# EAGLE design StrainGageAmpSMD (EAGLE 9.6.2)
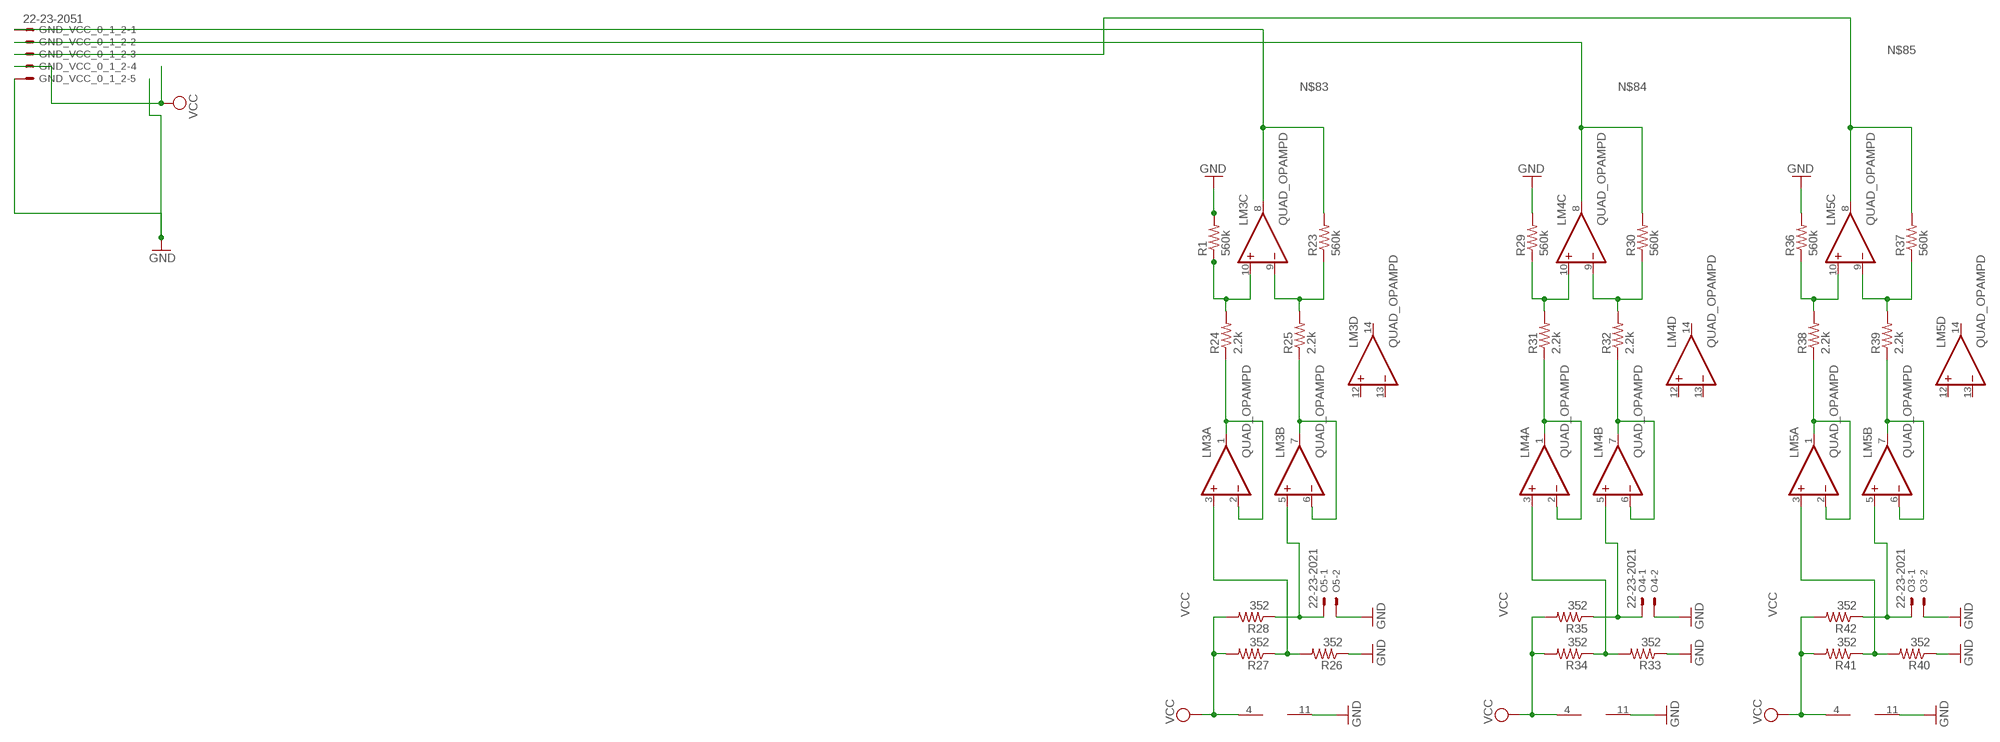
[diagram p0: schematic, sheet 1]

## Parts
GND_VCC_0_1_2  22-23-2051  [22-23-2051]
LM3  QUAD_OPAMPD  [SO14]
LM4  QUAD_OPAMPD  [SO14]
LM5  QUAD_OPAMPD  [SO14]
O3  22-23-2021  [22-23-2021]
O4  22-23-2021  [22-23-2021]
O5  22-23-2021  [22-23-2021]
R1  560k  R-US_R0603  [R0603]
R23  560k  R-US_R0603  [R0603]
R24  2.2k  R-US_R0603  [R0603]
R25  2.2k  R-US_R0603  [R0603]
R26  352  R-US_R0603  [R0603]
R27  352  R-US_R0603  [R0603]
R28  352  R-US_R0603  [R0603]
R29  560k  R-US_R0603  [R0603]
R30  560k  R-US_R0603  [R0603]
R31  2.2k  R-US_R0603  [R0603]
R32  2.2k  R-US_R0603  [R0603]
R33  352  R-US_R0603  [R0603]
R34  352  R-US_R0603  [R0603]
R35  352  R-US_R0603  [R0603]
R36  560k  R-US_R0603  [R0603]
R37  560k  R-US_R0603  [R0603]
R38  2.2k  R-US_R0603  [R0603]
R39  2.2k  R-US_R0603  [R0603]
R40  352  R-US_R0603  [R0603]
R41  352  R-US_R0603  [R0603]
R42  352  R-US_R0603  [R0603]

## Nets
GND: GND_VCC_0_1_2.5 LM3.11(P:V-) LM4.11(P:V-) LM5.11(P:V-) O3.2 O4.2 O5.2 R1.2 R26.1 R29.2 R33.1 R36.2 R40.1
N$21: LM3.3(A:+IN) R26.2 R27.1
N$22: LM3.5(B:+IN) O5.1 R28.1
N$23: LM3.1(A:OUT) LM3.2(A:-IN) R24.1
N$24: LM3.6(B:-IN) LM3.7(B:OUT) R25.1
N$25: LM3.9(C:-IN) R23.1 R25.2
N$26: LM3.10(C:+IN) R1.1 R24.2
N$27: LM4.3(A:+IN) R33.2 R34.1
N$28: LM4.5(B:+IN) O4.1 R35.1
N$29: LM4.1(A:OUT) LM4.2(A:-IN) R31.1
N$30: LM4.6(B:-IN) LM4.7(B:OUT) R32.1
N$31: LM4.9(C:-IN) R30.1 R32.2
N$32: LM4.10(C:+IN) R29.1 R31.2
N$33: LM5.3(A:+IN) R40.2 R41.1
N$34: LM5.5(B:+IN) O3.1 R42.1
N$35: LM5.1(A:OUT) LM5.2(A:-IN) R38.1
N$36: LM5.6(B:-IN) LM5.7(B:OUT) R39.1
N$37: LM5.9(C:-IN) R37.1 R39.2
N$38: LM5.10(C:+IN) R36.1 R38.2
N$83: GND_VCC_0_1_2.1 LM3.8(C:OUT) R23.2
N$84: GND_VCC_0_1_2.2 LM4.8(C:OUT) R30.2
N$85: GND_VCC_0_1_2.3 LM5.8(C:OUT) R37.2
VCC: GND_VCC_0_1_2.4 LM3.4(P:V+) LM4.4(P:V+) LM5.4(P:V+) R27.2 R28.2 R34.2 R35.2 R41.2 R42.2
Unconnected: LM3.12(D:+IN) LM3.13(D:-IN) LM3.14(D:OUT) LM4.12(D:+IN) LM4.13(D:-IN) LM4.14(D:OUT) LM5.12(D:+IN) LM5.13(D:-IN) LM5.14(D:OUT)

## Library data of the parts
GND_VCC_0_1_2 = con-molex:22-23-2051: .100" (2.54mm) Center Header - 5 Pin; MF: MOLEX; MPN: 22-23-2051; OC_FARNELL: 1462952; OC_NEWARK: 38C9178
LM3-LM5 = adafruit:QUAD_OPAMP: OP AMP Standard quad package
O3-O5 = con-molex:22-23-2021: .100" (2.54mm) Center Header - 2 Pin; MF: MOLEX; MPN: 22-23-2021; OC_FARNELL: 1462926; OC_NEWARK: 25C3832
R1 = rcl:R-US_: RESISTOR, American symbol; SPICEPREFIX: R
R23-R42 = adafruit:R-US_: RESISTOR, American symbol

## Module AMP
Ports: 

### Library data of the parts

## Net classes
0 default: width 0.203 mm, drill 0.254 mm, clearance 0.254 mm

## Board
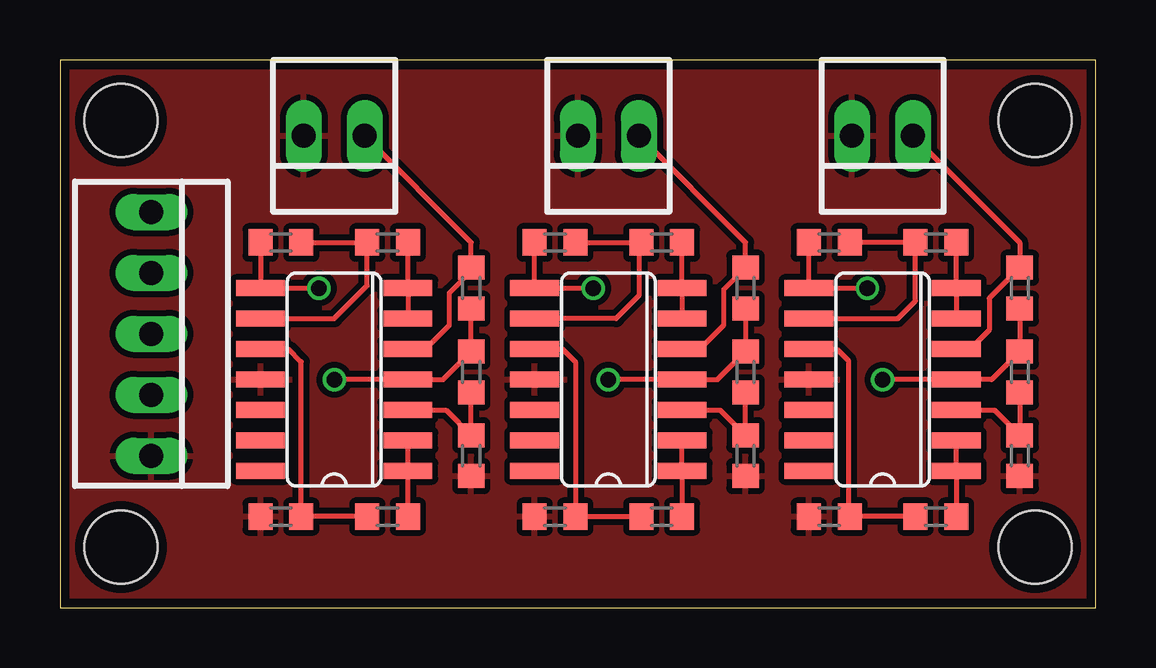
[diagram p1: board, top side]
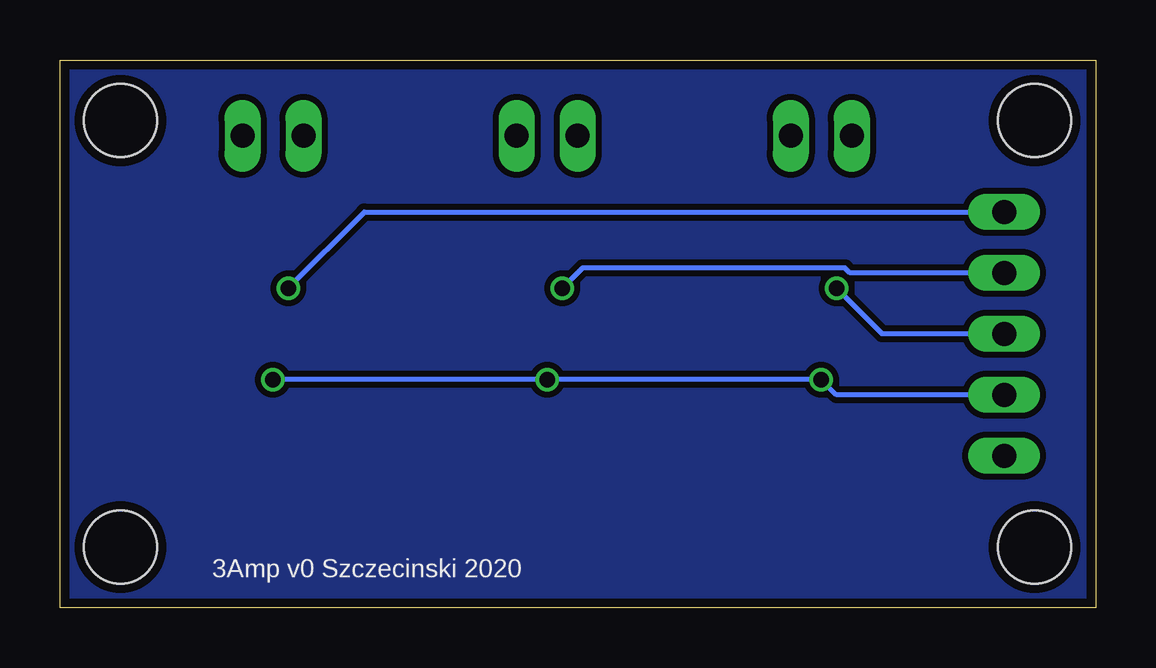
[diagram p2: board, bottom side, seen from below]

Size 43.17 x 22.85 mm. Coordinates in mm from the lower left corner, seen from the top.
Outline: 0,0 43.17,0 43.17,22.85 0,22.85 0,0
Copper layers (1*16): Top 0.035559375mm / dielectric 1.6mm / Bottom 0.035559375mm
Design rules "oshparkrules *": minimum track width 6mil, minimum drill 10mil, track to track 6mil, track to pad 6mil, pad to pad 6mil, via to via 6mil, smd to smd 6mil, copper to edge 15mil, drill to drill 6mil, minimum pad ring 5mil, minimum via ring 5mil, stop-mask expansion 2.5mil, vias tented up to drill 0mil, thermal gap 10mil
Holes 3.05 mm at 2.54,20.32 40.64,20.32 40.64,2.54 2.54,2.54

### Footprints (pad centres in the part's own frame; a part is rotated, then mirrored left to right if it is on the bottom)
22-23-2051 = drill 1 long: 1 -5.08,0; 2 -2.54,0; 3 0,0; 4 2.54,0; 5 5.08,0
SO14 = smd 0.66 x 2.032: 1 -3.81,-3.073; 2 -2.54,-3.073; 3 -1.27,-3.073; 4 0,-3.073; 5 1.27,-3.073; 6 2.54,-3.073; 7 3.81,-3.073; 8 3.81,3.073; 9 2.54,3.073; 10 1.27,3.073; 11 0,3.073; 12 -1.27,3.073; 13 -2.54,3.073; 14 -3.81,3.073
22-23-2021 = drill 1 long: 1 -1.27,0; 2 1.27,0
R0603 = smd 1 x 1.1: 1 -0.85,0; 2 0.85,0

### Placement (x,y rotation side)
GND_VCC_0_1_2  3.81,11.43 270 top
LM3  34.29,9.53 90 top
LM4  22.86,9.53 90 top
LM5  11.43,9.53 90 top
O3  11.43,19.68 180 top
O4  22.86,19.68 180 top
O5  34.29,19.68 180 top
R1  32.07,3.81 180 top
R23  32.07,15.24 180 top
R24  36.51,3.81 180 top
R25  36.51,15.24 180 top
R26  40,6.35 90 top
R27  40,9.84 90 top
R28  40,13.34 270 top
R29  20.64,3.81 180 top
R30  20.64,15.24 180 top
R31  25.08,3.81 180 top
R32  25.08,15.24 180 top
R33  28.57,6.35 90 top
R34  28.57,9.84 90 top
R35  28.57,13.34 270 top
R36  9.21,3.81 180 top
R37  9.21,15.24 180 top
R38  13.65,3.81 180 top
R39  13.65,15.24 180 top
R40  17.14,6.35 90 top
R41  17.14,9.84 90 top
R42  17.14,13.34 270 top

### Tracks (layer width: path | path; a pad name or v marks a point on that pad's centre or on a via)
GND
  pour Top: 0,22.86 0,0 43.18,0 43.18,22.86
N$9
  pour Bottom: 0,22.86 0,0 43.18,0 43.18,22.86
N$21
  Top 0.203: R27.1 R26.2 38.95,8.26 LM3.3
N$22
  Top 0.203: LM3.5 37.59,10.57 38.1,10.57 38.1,10.95 38.73,11.59 38.73,12.92 R28.1 40,15.24 O5.1
N$23
  Top 0.203: LM3.2 LM3.1 R24.1
N$24
  Top 0.203: LM3.6 LM3.7 R25.1
N$25
  Top 0.203: R23.1 R25.2 35.66,12.8 34.92,12.07 LM3.9
N$26
  Top 0.203: R24.2 R1.1 32.85,3.87 32.85,10.33 32.38,10.79 LM3.10
N$27
  Top 0.203: LM4.3 27.52,8.26 R33.2 R34.1
N$28
  Top 0.203: 25.08,10.79 LM4.5 26.67,10.79 27.67,11.79 27.67,13.28 R35.1 28.57,15.24 O4.1
N$29
  Top 0.203: LM4.2 LM4.1 R31.1
N$30
  Top 0.203: R32.1 LM4.7 LM4.6
N$31
  Top 0.203: R30.1 R32.2 24.13,15.14 24.13,13.02 23.18,12.07 LM4.9
N$32
  Top 0.203: R31.2 R29.1 21.49,10.26 20.96,10.79 LM4.10
N$33
  Top 0.203: LM5.3 16.09,8.26 R40.2 R41.1
N$34
  Top 0.203: LM5.5 15.24,10.79 16.24,11.79 16.24,13.13 17.14,14.04 R42.1 17.14,15.24 O3.1
N$35
  Top 0.203: LM5.2 LM5.1 R38.1
N$36
  Top 0.203: LM5.6 LM5.7 R39.1
N$37
  Top 0.203: R37.1 R39.2 12.8,13.44 11.43,12.07 LM5.9
N$38
  Top 0.203: R38.2 R36.1 10.06,10.26 9.53,10.79 LM5.10
N$83  (via drill 0.65)
  Top 0.203: R23.2 LM3.8 v33.65,13.34
  Bottom 0.203: v33.65,13.34 30.48,16.51 GND_VCC_0_1_2.1
N$84  (via drill 0.65)
  Top 0.203: v22.23,13.34 LM4.8 R30.2
  Bottom 0.203: GND_VCC_0_1_2.2 10.24,13.97 10.45,14.18 21.38,14.18 v22.23,13.34
N$85  (via drill 0.65)
  Top 0.203: R37.2 LM5.8 v10.79,13.34
  Bottom 0.203: v10.79,13.34 8.89,11.43 GND_VCC_0_1_2.3
VCC  (via drill 0.65)
  Top 0.203: R42.2 R41.2 15.98,9.53 LM5.4 v11.43,9.53 | LM3.4 37.41,9.47 37.89,9.47 | LM3.4 38.84,9.53 R27.2 R28.2 | LM3.4 v34.29,9.53 | v22.86,9.53 LM4.4 27.41,9.53 R34.2 R35.2
  Bottom 0.203: GND_VCC_0_1_2.4 10.79,8.89 v11.43,9.53 v22.86,9.53 v34.29,9.53

### Text on the board
bNames: 3Amp v0 Szczecinski 2020
tNames: 0 | 1 | 2 | 2 | 1 | 0 | VCC | GND